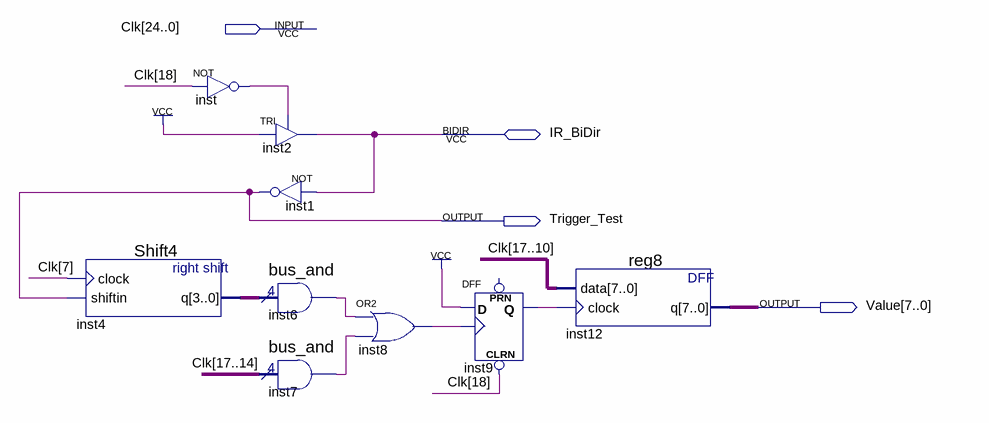
[diagram p0: schematic sheet]
// Quartus schematic IR_Sensor.bdf as structural Verilog: 9 symbols, 4 pins
module IR_Sensor (
  input  [24:0] Clk,
  inout  IR_BiDir,
  output Trigger_Test,
  output [7:0] Value
);

  wire inst6_result, inst7_result, inst8_out, inst9_q, inst_out;
  wire [3:0] inst4_q;

  Shift4 inst4 (.clock(Clk[7]), .shiftin(Trigger_Test), .q(inst4_q));
  not inst (inst_out, Clk[18]);
  TRI inst2 (.IN(1'b1), .OE(inst_out), .OUT(IR_BiDir));
  not inst1 (Trigger_Test, IR_BiDir);
  bus_and inst6 (.data(inst4_q), .result(inst6_result));
  bus_and inst7 (.data(Clk[17:14]), .result(inst7_result));
  or inst8 (inst8_out, inst6_result, inst7_result);
  DFF inst9 (.CLRN(Clk[18]), .CLK(inst8_out), .D(1'b1), .Q(inst9_q));  // open: PRN
  reg8 inst12 (.data(Clk[17:10]), .clock(inst9_q), .q(Value));
endmodule
